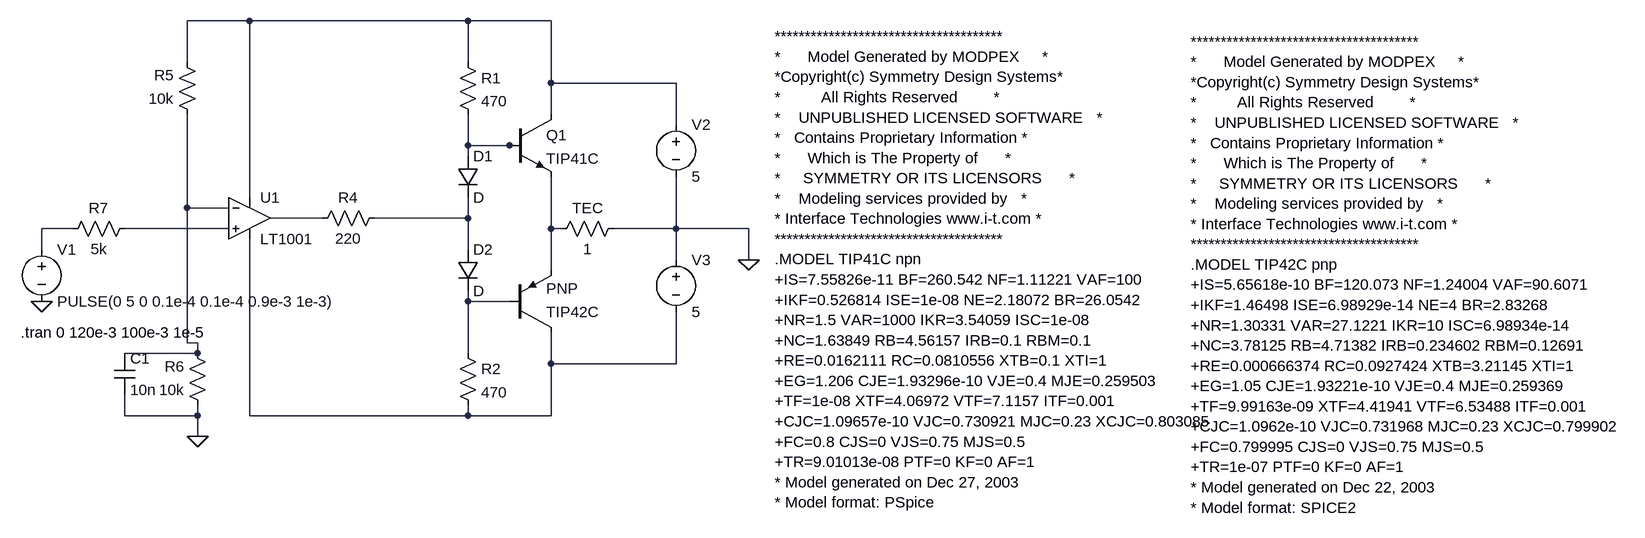
[diagram p0: schematic pushpullwithdcshifting.asc]
pushpullwithdcshifting.asc, the LTspice schematic file:
Version 4
SHEET 1 2300 680
WIRE 176 16 80 16
WIRE 512 16 176 16
WIRE 640 16 512 16
WIRE 80 80 80 16
WIRE 512 80 512 16
WIRE 640 112 640 16
WIRE 832 112 640 112
WIRE 640 160 640 112
WIRE 832 176 832 112
WIRE 512 208 512 160
WIRE 576 208 512 208
WIRE 592 208 576 208
WIRE 512 224 512 208
WIRE 176 288 176 16
WIRE 80 304 80 160
WIRE 144 304 80 304
WIRE 288 320 208 320
WIRE 512 320 512 288
WIRE 512 320 368 320
WIRE -96 336 -144 336
WIRE 144 336 -16 336
WIRE 640 336 640 256
WIRE 656 336 640 336
WIRE 832 336 832 256
WIRE 832 336 736 336
WIRE 944 336 832 336
WIRE -144 368 -144 336
WIRE 512 368 512 320
WIRE 832 384 832 336
WIRE 944 384 944 336
WIRE 640 400 640 336
WIRE 512 448 512 432
WIRE 576 448 512 448
WIRE 80 512 80 304
WIRE 96 512 80 512
WIRE 96 528 96 512
WIRE 96 528 -16 528
WIRE 512 528 512 448
WIRE 640 544 640 496
WIRE 832 544 832 464
WIRE 832 544 640 544
WIRE -16 624 -16 592
WIRE 96 624 96 608
WIRE 96 624 -16 624
WIRE 176 624 176 352
WIRE 512 624 512 608
WIRE 512 624 176 624
WIRE 640 624 640 544
WIRE 640 624 512 624
WIRE 96 656 96 624
FLAG 944 384 0
FLAG 96 656 0
FLAG -144 448 0
SYMBOL diode 496 224 R0
SYMATTR InstName D1
SYMBOL diode 496 368 R0
SYMATTR InstName D2
SYMBOL res 496 64 R0
SYMATTR InstName R1
SYMATTR Value 470
SYMBOL res 496 512 R0
SYMATTR InstName R2
SYMATTR Value 470
SYMBOL res 752 320 R90
WINDOW 0 0 56 VBottom 2
WINDOW 3 32 56 VTop 2
SYMATTR InstName TEC
SYMATTR Value 1
SYMBOL res 384 304 R90
WINDOW 0 0 56 VBottom 2
WINDOW 3 32 56 VTop 2
SYMATTR InstName R4
SYMATTR Value 220
SYMBOL res 96 176 R180
WINDOW 0 36 76 Left 2
WINDOW 3 36 40 Left 2
SYMATTR InstName R5
SYMATTR Value 10k
SYMBOL res 112 624 R180
WINDOW 0 36 76 Left 2
WINDOW 3 36 40 Left 2
SYMATTR InstName R6
SYMATTR Value 10k
SYMBOL npn 576 160 R0
SYMATTR InstName Q1
SYMATTR Value TIP41C
SYMBOL Opamps/LT1001 176 256 R0
SYMATTR InstName U1
SYMBOL res 0 320 R90
WINDOW 0 0 56 VBottom 2
WINDOW 3 32 56 VTop 2
SYMATTR InstName R7
SYMATTR Value 5k
SYMBOL voltage -144 352 R0
SYMATTR InstName V1
SYMATTR Value PULSE(0 5 0 0.1e-4 0.1e-4 0.9e-3 1e-3)
SYMBOL voltage 832 160 R0
SYMATTR InstName V2
SYMATTR Value 5
SYMBOL voltage 832 368 R0
SYMATTR InstName V3
SYMATTR Value 5
SYMBOL pnp 576 496 M180
SYMATTR InstName TIP42C
SYMBOL cap -32 528 R0
SYMATTR InstName C1
SYMATTR Value 10n
TEXT -176 496 Left 2 !.tran 0 120e-3 100e-3 1e-5
TEXT 984 40 Left 2 !**************************************\n*      Model Generated by MODPEX     *\n*Copyright(c) Symmetry Design Systems*\n*         All Rights Reserved        *\n*    UNPUBLISHED LICENSED SOFTWARE   *\n*   Contains Proprietary Information *\n*      Which is The Property of      *\n*     SYMMETRY OR ITS LICENSORS      *\n*    Modeling services provided by   *\n* Interface Technologies www.i-t.com *\n**************************************\n.MODEL TIP41C npn\n+IS=7.55826e-11 BF=260.542 NF=1.11221 VAF=100\n+IKF=0.526814 ISE=1e-08 NE=2.18072 BR=26.0542\n+NR=1.5 VAR=1000 IKR=3.54059 ISC=1e-08\n+NC=1.63849 RB=4.56157 IRB=0.1 RBM=0.1\n+RE=0.0162111 RC=0.0810556 XTB=0.1 XTI=1\n+EG=1.206 CJE=1.93296e-10 VJE=0.4 MJE=0.259503\n+TF=1e-08 XTF=4.06972 VTF=7.1157 ITF=0.001\n+CJC=1.09657e-10 VJC=0.730921 MJC=0.23 XCJC=0.803085\n+FC=0.8 CJS=0 VJS=0.75 MJS=0.5\n+TR=9.01013e-08 PTF=0 KF=0 AF=1\n* Model generated on Dec 27, 2003\n* Model format: PSpice
TEXT 1624 48 Left 2 !**************************************\n*      Model Generated by MODPEX     *\n*Copyright(c) Symmetry Design Systems*\n*         All Rights Reserved        *\n*    UNPUBLISHED LICENSED SOFTWARE   *\n*   Contains Proprietary Information *\n*      Which is The Property of      *\n*     SYMMETRY OR ITS LICENSORS      *\n*    Modeling services provided by   *\n* Interface Technologies www.i-t.com *\n**************************************\n.MODEL TIP42C pnp\n+IS=5.65618e-10 BF=120.073 NF=1.24004 VAF=90.6071\n+IKF=1.46498 ISE=6.98929e-14 NE=4 BR=2.83268\n+NR=1.30331 VAR=27.1221 IKR=10 ISC=6.98934e-14\n+NC=3.78125 RB=4.71382 IRB=0.234602 RBM=0.12691\n+RE=0.000666374 RC=0.0927424 XTB=3.21145 XTI=1\n+EG=1.05 CJE=1.93221e-10 VJE=0.4 MJE=0.259369\n+TF=9.99163e-09 XTF=4.41941 VTF=6.53488 ITF=0.001\n+CJC=1.0962e-10 VJC=0.731968 MJC=0.23 XCJC=0.799902\n+FC=0.799995 CJS=0 VJS=0.75 MJS=0.5\n+TR=1e-07 PTF=0 KF=0 AF=1\n* Model generated on Dec 22, 2003\n* Model format: SPICE2

The netlist it stands for:
* pushpullwithdcshifting.asc
D1 N002 N005 D
D2 N005 N009 D
R1 N001 N002 470
R2 N009 N010 470
R§TEC 0 N008 1
R4 N005 N004 220
R5 N003 N001 10k
R6 0 N003 10k
Q1 N001 N002 N008 0 TIP41C
XU1 N007 N003 N001 N010 N004 LT1001  ; pins In+ In- V+ V- OUT
R7 N007 N006 5k
V1 N006 0 PULSE(0 5 0 0.1e-4 0.1e-4 0.9e-3 1e-3)
V2 N001 0 5
V3 0 N010 5
Q§TIP42C N010 N009 N008 0 PNP
C1 N003 0 10n
.model D D
.lib standard.dio
.model NPN NPN
.model PNP PNP
.lib standard.bjt
.tran 0 120e-3 100e-3 1e-5
**************************************
*      Model Generated by MODPEX     *
*Copyright(c) Symmetry Design Systems*
*         All Rights Reserved        *
*    UNPUBLISHED LICENSED SOFTWARE   *
*   Contains Proprietary Information *
*      Which is The Property of      *
*     SYMMETRY OR ITS LICENSORS      *
*    Modeling services provided by   *
* Interface Technologies www.i-t.com *
**************************************
.MODEL TIP41C npn
+IS=7.55826e-11 BF=260.542 NF=1.11221 VAF=100
+IKF=0.526814 ISE=1e-08 NE=2.18072 BR=26.0542
+NR=1.5 VAR=1000 IKR=3.54059 ISC=1e-08
+NC=1.63849 RB=4.56157 IRB=0.1 RBM=0.1
+RE=0.0162111 RC=0.0810556 XTB=0.1 XTI=1
+EG=1.206 CJE=1.93296e-10 VJE=0.4 MJE=0.259503
+TF=1e-08 XTF=4.06972 VTF=7.1157 ITF=0.001
+CJC=1.09657e-10 VJC=0.730921 MJC=0.23 XCJC=0.803085
+FC=0.8 CJS=0 VJS=0.75 MJS=0.5
+TR=9.01013e-08 PTF=0 KF=0 AF=1
* Model generated on Dec 27, 2003
* Model format: PSpice
**************************************
*      Model Generated by MODPEX     *
*Copyright(c) Symmetry Design Systems*
*         All Rights Reserved        *
*    UNPUBLISHED LICENSED SOFTWARE   *
*   Contains Proprietary Information *
*      Which is The Property of      *
*     SYMMETRY OR ITS LICENSORS      *
*    Modeling services provided by   *
* Interface Technologies www.i-t.com *
**************************************
.MODEL TIP42C pnp
+IS=5.65618e-10 BF=120.073 NF=1.24004 VAF=90.6071
+IKF=1.46498 ISE=6.98929e-14 NE=4 BR=2.83268
+NR=1.30331 VAR=27.1221 IKR=10 ISC=6.98934e-14
+NC=3.78125 RB=4.71382 IRB=0.234602 RBM=0.12691
+RE=0.000666374 RC=0.0927424 XTB=3.21145 XTI=1
+EG=1.05 CJE=1.93221e-10 VJE=0.4 MJE=0.259369
+TF=9.99163e-09 XTF=4.41941 VTF=6.53488 ITF=0.001
+CJC=1.0962e-10 VJC=0.731968 MJC=0.23 XCJC=0.799902
+FC=0.799995 CJS=0 VJS=0.75 MJS=0.5
+TR=1e-07 PTF=0 KF=0 AF=1
* Model generated on Dec 22, 2003
* Model format: SPICE2
.lib LTC.lib
.backanno
.end